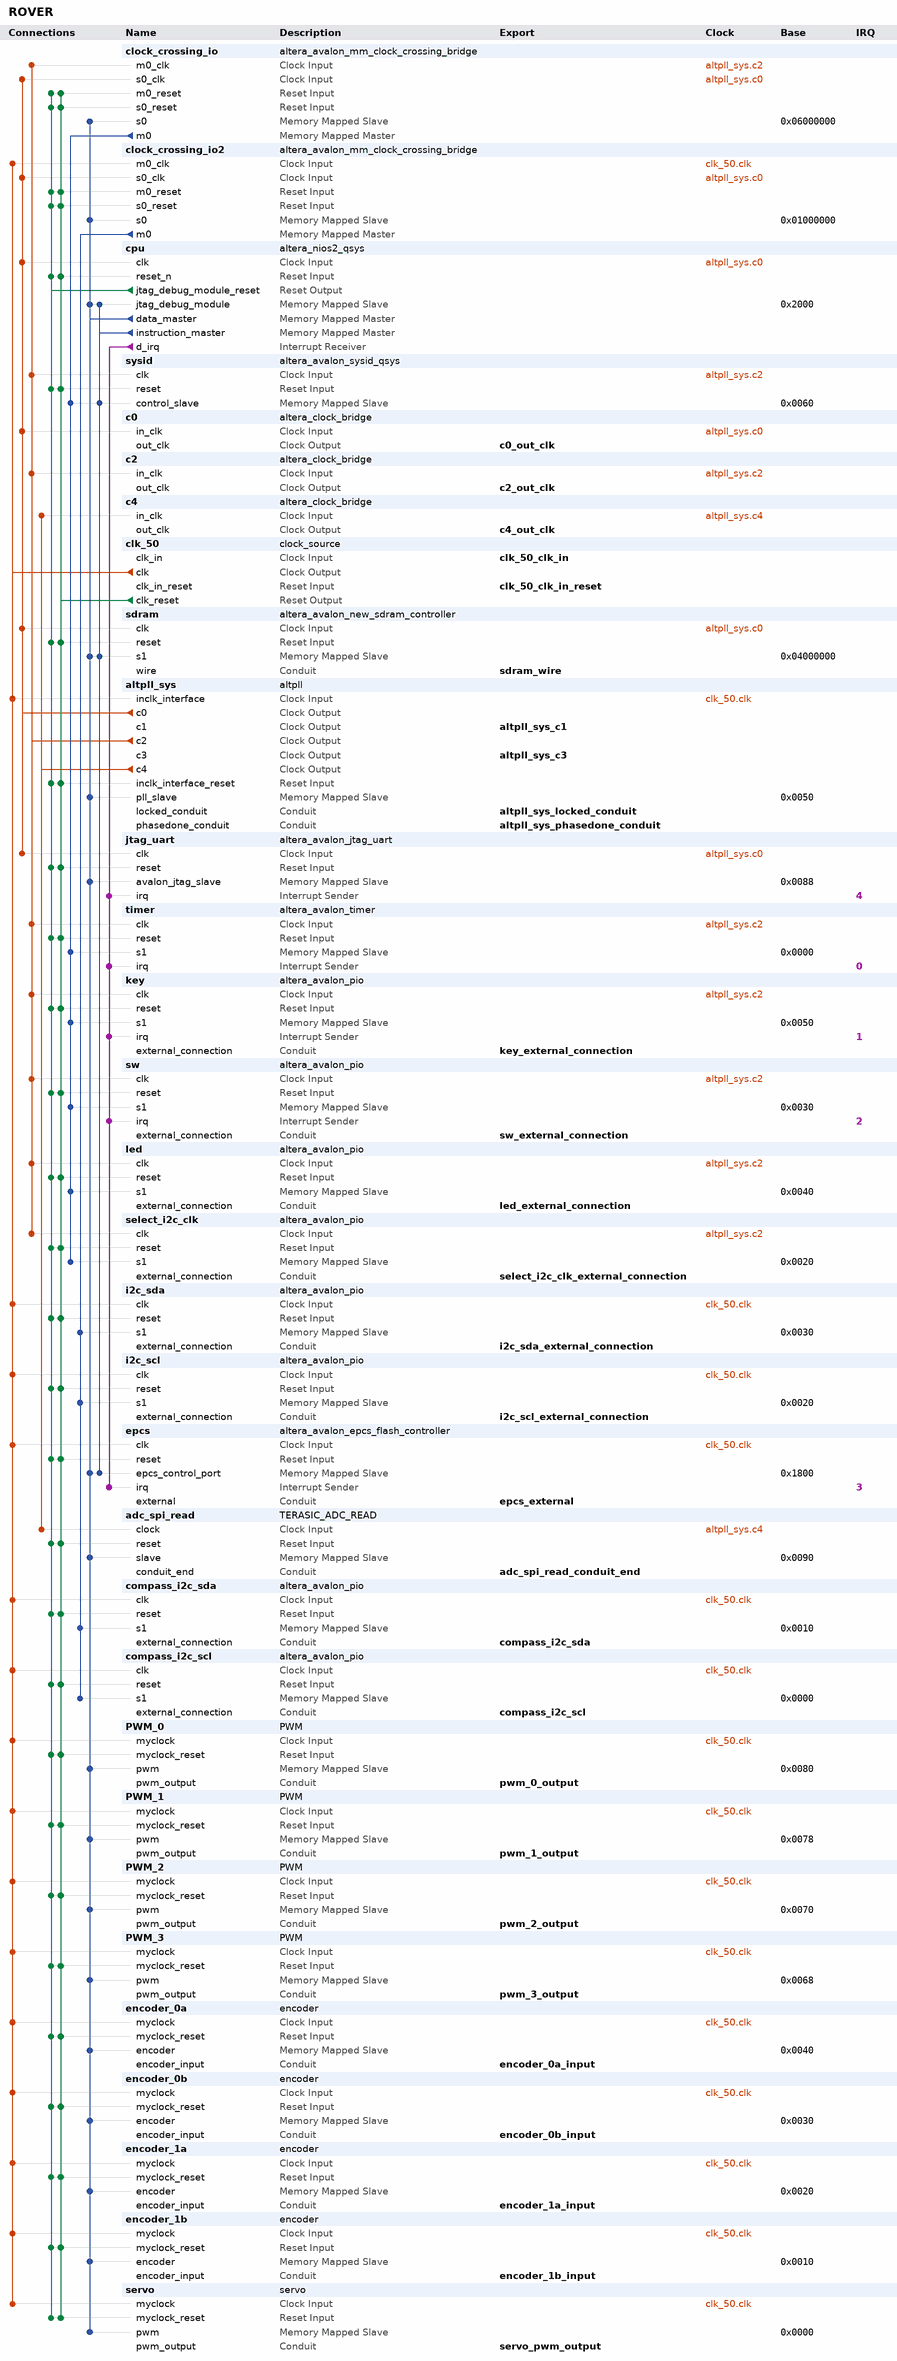
[diagram p0: system contents]
# Platform Designer (Qsys) system ROVER, Cyclone IV E EP4CE22F17C6
# Parameters at their usual value, and those the tool derives, are not listed.
package require -exact qsys 12.1
create_system ROVER
set_project_property DEVICE_FAMILY {Cyclone IV E}
set_project_property DEVICE EP4CE22F17C6

add_instance clock_crossing_io altera_avalon_mm_clock_crossing_bridge 12.1
set_instance_parameter_value clock_crossing_io DATA_WIDTH 32
set_instance_parameter_value clock_crossing_io ADDRESS_WIDTH 7
set_instance_parameter_value clock_crossing_io MAX_BURST_SIZE 1
set_instance_parameter_value clock_crossing_io COMMAND_FIFO_DEPTH 16
set_instance_parameter_value clock_crossing_io RESPONSE_FIFO_DEPTH 32
set_instance_parameter_value clock_crossing_io MASTER_SYNC_DEPTH 3
set_instance_parameter_value clock_crossing_io SLAVE_SYNC_DEPTH 3

add_instance clock_crossing_io2 altera_avalon_mm_clock_crossing_bridge 12.1
set_instance_parameter_value clock_crossing_io2 DATA_WIDTH 32
set_instance_parameter_value clock_crossing_io2 ADDRESS_WIDTH 12
set_instance_parameter_value clock_crossing_io2 MAX_BURST_SIZE 1
set_instance_parameter_value clock_crossing_io2 COMMAND_FIFO_DEPTH 16
set_instance_parameter_value clock_crossing_io2 RESPONSE_FIFO_DEPTH 64
set_instance_parameter_value clock_crossing_io2 MASTER_SYNC_DEPTH 3
set_instance_parameter_value clock_crossing_io2 SLAVE_SYNC_DEPTH 3

add_instance cpu altera_nios2_qsys 12.1
set_instance_parameter_value cpu manuallyAssignCpuID false
set_instance_parameter_value cpu resetSlave epcs.epcs_control_port
set_instance_parameter_value cpu exceptionSlave sdram.s1
set_instance_parameter_value cpu breakSlave cpu.jtag_debug_module
set_instance_parameter_value cpu impl Tiny
set_instance_parameter_value cpu icache_size 1024
set_instance_parameter_value cpu dcache_size 512

add_instance sysid altera_avalon_sysid_qsys 12.1
set_instance_parameter_value sysid id 0

add_instance c0 altera_clock_bridge 12.1
set_instance_parameter_value c0 DERIVED_CLOCK_RATE 100000000
set_instance_parameter_value c0 EXPLICIT_CLOCK_RATE 0

add_instance c2 altera_clock_bridge 12.1
set_instance_parameter_value c2 DERIVED_CLOCK_RATE 10000000
set_instance_parameter_value c2 EXPLICIT_CLOCK_RATE 0

add_instance c4 altera_clock_bridge 12.1
set_instance_parameter_value c4 DERIVED_CLOCK_RATE 2000000
set_instance_parameter_value c4 EXPLICIT_CLOCK_RATE 0

add_instance clk_50 clock_source 12.1
set_instance_parameter_value clk_50 clockFrequency 50000000

add_instance sdram altera_avalon_new_sdram_controller 12.1
set_instance_parameter_value sdram TAC 5.5
set_instance_parameter_value sdram TRCD 20.0
set_instance_parameter_value sdram TRP 20.0
set_instance_parameter_value sdram casLatency 3
set_instance_parameter_value sdram columnWidth 9
set_instance_parameter_value sdram dataWidth 16
set_instance_parameter_value sdram generateSimulationModel true
set_instance_parameter_value sdram model custom
set_instance_parameter_value sdram numberOfBanks 4
set_instance_parameter_value sdram numberOfChipSelects 1
set_instance_parameter_value sdram powerUpDelay 100.0
set_instance_parameter_value sdram refreshPeriod 15.625
set_instance_parameter_value sdram rowWidth 13

add_instance altpll_sys altpll 12.1
set_instance_parameter_value altpll_sys INCLK0_INPUT_FREQUENCY 20000
set_instance_parameter_value altpll_sys CLK0_MULTIPLY_BY 2
set_instance_parameter_value altpll_sys CLK1_MULTIPLY_BY 2
set_instance_parameter_value altpll_sys CLK2_MULTIPLY_BY 1
set_instance_parameter_value altpll_sys CLK3_MULTIPLY_BY 4
set_instance_parameter_value altpll_sys CLK4_MULTIPLY_BY 1
set_instance_parameter_value altpll_sys CLK0_DIVIDE_BY 1
set_instance_parameter_value altpll_sys CLK1_DIVIDE_BY 1
set_instance_parameter_value altpll_sys CLK2_DIVIDE_BY 5
set_instance_parameter_value altpll_sys CLK3_DIVIDE_BY 5
set_instance_parameter_value altpll_sys CLK4_DIVIDE_BY 25
set_instance_parameter_value altpll_sys CLK1_PHASE_SHIFT -1667
set_instance_parameter_value altpll_sys CLK2_PHASE_SHIFT 0
set_instance_parameter_value altpll_sys CLK3_PHASE_SHIFT 0
set_instance_parameter_value altpll_sys CLK4_PHASE_SHIFT 0
set_instance_parameter_value altpll_sys CLK1_DUTY_CYCLE 50
set_instance_parameter_value altpll_sys CLK2_DUTY_CYCLE 50
set_instance_parameter_value altpll_sys CLK3_DUTY_CYCLE 50
set_instance_parameter_value altpll_sys CLK4_DUTY_CYCLE 50
set_instance_parameter_value altpll_sys PORT_clk1 PORT_USED
set_instance_parameter_value altpll_sys PORT_clk2 PORT_USED
set_instance_parameter_value altpll_sys PORT_clk3 PORT_USED
set_instance_parameter_value altpll_sys PORT_clk4 PORT_USED
set_instance_parameter_value altpll_sys PORT_ARESET PORT_USED
set_instance_parameter_value altpll_sys PORT_LOCKED PORT_USED

add_instance jtag_uart altera_avalon_jtag_uart 12.1
set_instance_parameter_value jtag_uart simInteractiveOptions INTERACTIVE_ASCII_OUTPUT

add_instance timer altera_avalon_timer 12.1
set_instance_parameter_value timer period 1
set_instance_parameter_value timer periodUnits MSEC
set_instance_parameter_value timer timerPreset CUSTOM

add_instance key altera_avalon_pio 12.1
set_instance_parameter_value key captureEdge true
set_instance_parameter_value key direction Input
set_instance_parameter_value key edgeType FALLING
set_instance_parameter_value key generateIRQ true
set_instance_parameter_value key irqType EDGE
set_instance_parameter_value key width 2

add_instance sw altera_avalon_pio 12.1
set_instance_parameter_value sw captureEdge true
set_instance_parameter_value sw direction Input
set_instance_parameter_value sw edgeType ANY
set_instance_parameter_value sw generateIRQ true
set_instance_parameter_value sw irqType EDGE
set_instance_parameter_value sw width 4

add_instance led altera_avalon_pio 12.1
set_instance_parameter_value led direction Output
set_instance_parameter_value led width 8

add_instance select_i2c_clk altera_avalon_pio 12.1
set_instance_parameter_value select_i2c_clk direction Output
set_instance_parameter_value select_i2c_clk width 1

add_instance i2c_sda altera_avalon_pio 12.1
set_instance_parameter_value i2c_sda direction Bidir
set_instance_parameter_value i2c_sda resetValue 1
set_instance_parameter_value i2c_sda width 1

add_instance i2c_scl altera_avalon_pio 12.1
set_instance_parameter_value i2c_scl direction Output
set_instance_parameter_value i2c_scl resetValue 1
set_instance_parameter_value i2c_scl width 1

add_instance epcs altera_avalon_epcs_flash_controller 12.1

add_instance adc_spi_read TERASIC_ADC_READ 1.0

add_instance compass_i2c_sda altera_avalon_pio 12.1
set_instance_parameter_value compass_i2c_sda direction Bidir
set_instance_parameter_value compass_i2c_sda resetValue 1
set_instance_parameter_value compass_i2c_sda width 1

add_instance compass_i2c_scl altera_avalon_pio 12.1
set_instance_parameter_value compass_i2c_scl direction Output
set_instance_parameter_value compass_i2c_scl resetValue 1
set_instance_parameter_value compass_i2c_scl width 1

add_instance PWM_0 PWM 1.0

add_instance PWM_1 PWM 1.0

add_instance PWM_2 PWM 1.0

add_instance PWM_3 PWM 1.0

add_instance encoder_0a encoder 1.0

add_instance encoder_0b encoder 1.0

add_instance encoder_1a encoder 1.0

add_instance encoder_1b encoder 1.0

add_instance servo servo 1.0

# connections
add_connection altpll_sys.c0 c0.in_clk clock
add_connection altpll_sys.c0 clock_crossing_io2.s0_clk clock
add_connection altpll_sys.c0 clock_crossing_io.s0_clk clock
add_connection altpll_sys.c0 cpu.clk clock
add_connection altpll_sys.c0 jtag_uart.clk clock
add_connection altpll_sys.c0 sdram.clk clock
add_connection altpll_sys.c2 c2.in_clk clock
add_connection altpll_sys.c2 clock_crossing_io.m0_clk clock
add_connection altpll_sys.c2 key.clk clock
add_connection altpll_sys.c2 led.clk clock
add_connection altpll_sys.c2 select_i2c_clk.clk clock
add_connection altpll_sys.c2 sw.clk clock
add_connection altpll_sys.c2 sysid.clk clock
add_connection altpll_sys.c2 timer.clk clock
add_connection altpll_sys.c4 adc_spi_read.clock clock
add_connection altpll_sys.c4 c4.in_clk clock
add_connection clk_50.clk altpll_sys.inclk_interface clock
add_connection clk_50.clk clock_crossing_io2.m0_clk clock
add_connection clk_50.clk compass_i2c_scl.clk clock
add_connection clk_50.clk compass_i2c_sda.clk clock
add_connection clk_50.clk encoder_0a.myclock clock
add_connection clk_50.clk encoder_0b.myclock clock
add_connection clk_50.clk encoder_1a.myclock clock
add_connection clk_50.clk encoder_1b.myclock clock
add_connection clk_50.clk epcs.clk clock
add_connection clk_50.clk i2c_scl.clk clock
add_connection clk_50.clk i2c_sda.clk clock
add_connection clk_50.clk PWM_0.myclock clock
add_connection clk_50.clk PWM_1.myclock clock
add_connection clk_50.clk PWM_2.myclock clock
add_connection clk_50.clk PWM_3.myclock clock
add_connection clk_50.clk servo.myclock clock
add_connection clk_50.clk_reset adc_spi_read.reset reset
add_connection clk_50.clk_reset altpll_sys.inclk_interface_reset reset
add_connection clk_50.clk_reset clock_crossing_io2.m0_reset reset
add_connection clk_50.clk_reset clock_crossing_io2.s0_reset reset
add_connection clk_50.clk_reset clock_crossing_io.m0_reset reset
add_connection clk_50.clk_reset clock_crossing_io.s0_reset reset
add_connection clk_50.clk_reset compass_i2c_scl.reset reset
add_connection clk_50.clk_reset compass_i2c_sda.reset reset
add_connection clk_50.clk_reset cpu.reset_n reset
add_connection clk_50.clk_reset encoder_0a.myclock_reset reset
add_connection clk_50.clk_reset encoder_0b.myclock_reset reset
add_connection clk_50.clk_reset encoder_1a.myclock_reset reset
add_connection clk_50.clk_reset encoder_1b.myclock_reset reset
add_connection clk_50.clk_reset epcs.reset reset
add_connection clk_50.clk_reset i2c_scl.reset reset
add_connection clk_50.clk_reset i2c_sda.reset reset
add_connection clk_50.clk_reset jtag_uart.reset reset
add_connection clk_50.clk_reset key.reset reset
add_connection clk_50.clk_reset led.reset reset
add_connection clk_50.clk_reset PWM_0.myclock_reset reset
add_connection clk_50.clk_reset PWM_1.myclock_reset reset
add_connection clk_50.clk_reset PWM_2.myclock_reset reset
add_connection clk_50.clk_reset PWM_3.myclock_reset reset
add_connection clk_50.clk_reset sdram.reset reset
add_connection clk_50.clk_reset select_i2c_clk.reset reset
add_connection clk_50.clk_reset servo.myclock_reset reset
add_connection clk_50.clk_reset sw.reset reset
add_connection clk_50.clk_reset sysid.reset reset
add_connection clk_50.clk_reset timer.reset reset
add_connection cpu.jtag_debug_module_reset adc_spi_read.reset reset
add_connection cpu.jtag_debug_module_reset altpll_sys.inclk_interface_reset reset
add_connection cpu.jtag_debug_module_reset clock_crossing_io2.m0_reset reset
add_connection cpu.jtag_debug_module_reset clock_crossing_io2.s0_reset reset
add_connection cpu.jtag_debug_module_reset clock_crossing_io.m0_reset reset
add_connection cpu.jtag_debug_module_reset clock_crossing_io.s0_reset reset
add_connection cpu.jtag_debug_module_reset compass_i2c_scl.reset reset
add_connection cpu.jtag_debug_module_reset compass_i2c_sda.reset reset
add_connection cpu.jtag_debug_module_reset cpu.reset_n reset
add_connection cpu.jtag_debug_module_reset encoder_0a.myclock_reset reset
add_connection cpu.jtag_debug_module_reset encoder_0b.myclock_reset reset
add_connection cpu.jtag_debug_module_reset encoder_1a.myclock_reset reset
add_connection cpu.jtag_debug_module_reset encoder_1b.myclock_reset reset
add_connection cpu.jtag_debug_module_reset epcs.reset reset
add_connection cpu.jtag_debug_module_reset i2c_scl.reset reset
add_connection cpu.jtag_debug_module_reset i2c_sda.reset reset
add_connection cpu.jtag_debug_module_reset jtag_uart.reset reset
add_connection cpu.jtag_debug_module_reset key.reset reset
add_connection cpu.jtag_debug_module_reset led.reset reset
add_connection cpu.jtag_debug_module_reset PWM_0.myclock_reset reset
add_connection cpu.jtag_debug_module_reset PWM_1.myclock_reset reset
add_connection cpu.jtag_debug_module_reset PWM_2.myclock_reset reset
add_connection cpu.jtag_debug_module_reset PWM_3.myclock_reset reset
add_connection cpu.jtag_debug_module_reset sdram.reset reset
add_connection cpu.jtag_debug_module_reset select_i2c_clk.reset reset
add_connection cpu.jtag_debug_module_reset servo.myclock_reset reset
add_connection cpu.jtag_debug_module_reset sw.reset reset
add_connection cpu.jtag_debug_module_reset sysid.reset reset
add_connection cpu.jtag_debug_module_reset timer.reset reset
add_connection clock_crossing_io2.m0 compass_i2c_scl.s1 avalon
set_connection_parameter_value clock_crossing_io2.m0/compass_i2c_scl.s1 baseAddress 0x0000
add_connection clock_crossing_io2.m0 compass_i2c_sda.s1 avalon
set_connection_parameter_value clock_crossing_io2.m0/compass_i2c_sda.s1 baseAddress 0x0010
add_connection clock_crossing_io2.m0 i2c_scl.s1 avalon
set_connection_parameter_value clock_crossing_io2.m0/i2c_scl.s1 baseAddress 0x0020
add_connection clock_crossing_io2.m0 i2c_sda.s1 avalon
set_connection_parameter_value clock_crossing_io2.m0/i2c_sda.s1 baseAddress 0x0030
add_connection clock_crossing_io.m0 key.s1 avalon
set_connection_parameter_value clock_crossing_io.m0/key.s1 baseAddress 0x0050
add_connection clock_crossing_io.m0 led.s1 avalon
set_connection_parameter_value clock_crossing_io.m0/led.s1 baseAddress 0x0040
add_connection clock_crossing_io.m0 select_i2c_clk.s1 avalon
set_connection_parameter_value clock_crossing_io.m0/select_i2c_clk.s1 baseAddress 0x0020
add_connection clock_crossing_io.m0 sw.s1 avalon
set_connection_parameter_value clock_crossing_io.m0/sw.s1 baseAddress 0x0030
add_connection clock_crossing_io.m0 sysid.control_slave avalon
set_connection_parameter_value clock_crossing_io.m0/sysid.control_slave baseAddress 0x0060
add_connection clock_crossing_io.m0 timer.s1 avalon
set_connection_parameter_value clock_crossing_io.m0/timer.s1 baseAddress 0x0000
add_connection cpu.data_master adc_spi_read.slave avalon
set_connection_parameter_value cpu.data_master/adc_spi_read.slave baseAddress 0x0090
add_connection cpu.data_master altpll_sys.pll_slave avalon
set_connection_parameter_value cpu.data_master/altpll_sys.pll_slave baseAddress 0x0050
add_connection cpu.data_master clock_crossing_io2.s0 avalon
set_connection_parameter_value cpu.data_master/clock_crossing_io2.s0 baseAddress 0x01000000
add_connection cpu.data_master clock_crossing_io.s0 avalon
set_connection_parameter_value cpu.data_master/clock_crossing_io.s0 baseAddress 0x06000000
add_connection cpu.data_master cpu.jtag_debug_module avalon
set_connection_parameter_value cpu.data_master/cpu.jtag_debug_module baseAddress 0x2000
add_connection cpu.data_master encoder_0a.encoder avalon
set_connection_parameter_value cpu.data_master/encoder_0a.encoder baseAddress 0x0040
add_connection cpu.data_master encoder_0b.encoder avalon
set_connection_parameter_value cpu.data_master/encoder_0b.encoder baseAddress 0x0030
add_connection cpu.data_master encoder_1a.encoder avalon
set_connection_parameter_value cpu.data_master/encoder_1a.encoder baseAddress 0x0020
add_connection cpu.data_master encoder_1b.encoder avalon
set_connection_parameter_value cpu.data_master/encoder_1b.encoder baseAddress 0x0010
add_connection cpu.data_master epcs.epcs_control_port avalon
set_connection_parameter_value cpu.data_master/epcs.epcs_control_port baseAddress 0x1800
add_connection cpu.data_master jtag_uart.avalon_jtag_slave avalon
set_connection_parameter_value cpu.data_master/jtag_uart.avalon_jtag_slave baseAddress 0x0088
add_connection cpu.data_master PWM_0.pwm avalon
set_connection_parameter_value cpu.data_master/PWM_0.pwm baseAddress 0x0080
add_connection cpu.data_master PWM_1.pwm avalon
set_connection_parameter_value cpu.data_master/PWM_1.pwm baseAddress 0x0078
add_connection cpu.data_master PWM_2.pwm avalon
set_connection_parameter_value cpu.data_master/PWM_2.pwm baseAddress 0x0070
add_connection cpu.data_master PWM_3.pwm avalon
set_connection_parameter_value cpu.data_master/PWM_3.pwm baseAddress 0x0068
add_connection cpu.data_master sdram.s1 avalon
set_connection_parameter_value cpu.data_master/sdram.s1 baseAddress 0x04000000
add_connection cpu.data_master servo.pwm avalon
set_connection_parameter_value cpu.data_master/servo.pwm baseAddress 0x0000
add_connection cpu.instruction_master cpu.jtag_debug_module avalon
set_connection_parameter_value cpu.instruction_master/cpu.jtag_debug_module baseAddress 0x2000
add_connection cpu.instruction_master epcs.epcs_control_port avalon
set_connection_parameter_value cpu.instruction_master/epcs.epcs_control_port baseAddress 0x1800
add_connection cpu.instruction_master sdram.s1 avalon
set_connection_parameter_value cpu.instruction_master/sdram.s1 baseAddress 0x04000000
add_connection cpu.instruction_master sysid.control_slave avalon
set_connection_parameter_value cpu.instruction_master/sysid.control_slave baseAddress 0x0060
add_connection cpu.d_irq epcs.irq interrupt
set_connection_parameter_value cpu.d_irq/epcs.irq irqNumber 3
add_connection cpu.d_irq jtag_uart.irq interrupt
set_connection_parameter_value cpu.d_irq/jtag_uart.irq irqNumber 4
add_connection cpu.d_irq key.irq interrupt
set_connection_parameter_value cpu.d_irq/key.irq irqNumber 1
add_connection cpu.d_irq sw.irq interrupt
set_connection_parameter_value cpu.d_irq/sw.irq irqNumber 2
add_connection cpu.d_irq timer.irq interrupt
set_connection_parameter_value cpu.d_irq/timer.irq irqNumber 0

# exported interfaces
add_interface key_external_connection conduit end
set_interface_property key_external_connection EXPORT_OF key.external_connection
add_interface clk_50_clk_in clock sink
set_interface_property clk_50_clk_in EXPORT_OF clk_50.clk_in
add_interface altpll_sys_locked_conduit conduit end
set_interface_property altpll_sys_locked_conduit EXPORT_OF altpll_sys.locked_conduit
add_interface i2c_sda_external_connection conduit end
set_interface_property i2c_sda_external_connection EXPORT_OF i2c_sda.external_connection
add_interface clk_50_clk_in_reset reset sink
set_interface_property clk_50_clk_in_reset EXPORT_OF clk_50.clk_in_reset
add_interface c2_out_clk clock source
set_interface_property c2_out_clk EXPORT_OF c2.out_clk
add_interface led_external_connection conduit end
set_interface_property led_external_connection EXPORT_OF led.external_connection
add_interface select_i2c_clk_external_connection conduit end
set_interface_property select_i2c_clk_external_connection EXPORT_OF select_i2c_clk.external_connection
add_interface altpll_sys_phasedone_conduit conduit end
set_interface_property altpll_sys_phasedone_conduit EXPORT_OF altpll_sys.phasedone_conduit
add_interface i2c_scl_external_connection conduit end
set_interface_property i2c_scl_external_connection EXPORT_OF i2c_scl.external_connection
add_interface c0_out_clk clock source
set_interface_property c0_out_clk EXPORT_OF c0.out_clk
add_interface sdram_wire conduit end
set_interface_property sdram_wire EXPORT_OF sdram.wire
add_interface c4_out_clk clock source
set_interface_property c4_out_clk EXPORT_OF c4.out_clk
add_interface sw_external_connection conduit end
set_interface_property sw_external_connection EXPORT_OF sw.external_connection
add_interface adc_spi_read_conduit_end conduit end
set_interface_property adc_spi_read_conduit_end EXPORT_OF adc_spi_read.conduit_end
add_interface altpll_sys_c3 clock source
set_interface_property altpll_sys_c3 EXPORT_OF altpll_sys.c3
add_interface altpll_sys_c1 clock source
set_interface_property altpll_sys_c1 EXPORT_OF altpll_sys.c1
add_interface epcs_external conduit end
set_interface_property epcs_external EXPORT_OF epcs.external
add_interface compass_i2c_sda conduit end
set_interface_property compass_i2c_sda EXPORT_OF compass_i2c_sda.external_connection
add_interface compass_i2c_scl conduit end
set_interface_property compass_i2c_scl EXPORT_OF compass_i2c_scl.external_connection
add_interface pwm_0_output conduit end
set_interface_property pwm_0_output EXPORT_OF PWM_0.pwm_output
add_interface pwm_1_output conduit end
set_interface_property pwm_1_output EXPORT_OF PWM_1.pwm_output
add_interface pwm_2_output conduit end
set_interface_property pwm_2_output EXPORT_OF PWM_2.pwm_output
add_interface pwm_3_output conduit end
set_interface_property pwm_3_output EXPORT_OF PWM_3.pwm_output
add_interface encoder_0a_input conduit end
set_interface_property encoder_0a_input EXPORT_OF encoder_0a.encoder_input
add_interface encoder_0b_input conduit end
set_interface_property encoder_0b_input EXPORT_OF encoder_0b.encoder_input
add_interface encoder_1a_input conduit end
set_interface_property encoder_1a_input EXPORT_OF encoder_1a.encoder_input
add_interface encoder_1b_input conduit end
set_interface_property encoder_1b_input EXPORT_OF encoder_1b.encoder_input
add_interface servo_pwm_output conduit end
set_interface_property servo_pwm_output EXPORT_OF servo.pwm_output

save_system ROVER.qsys
